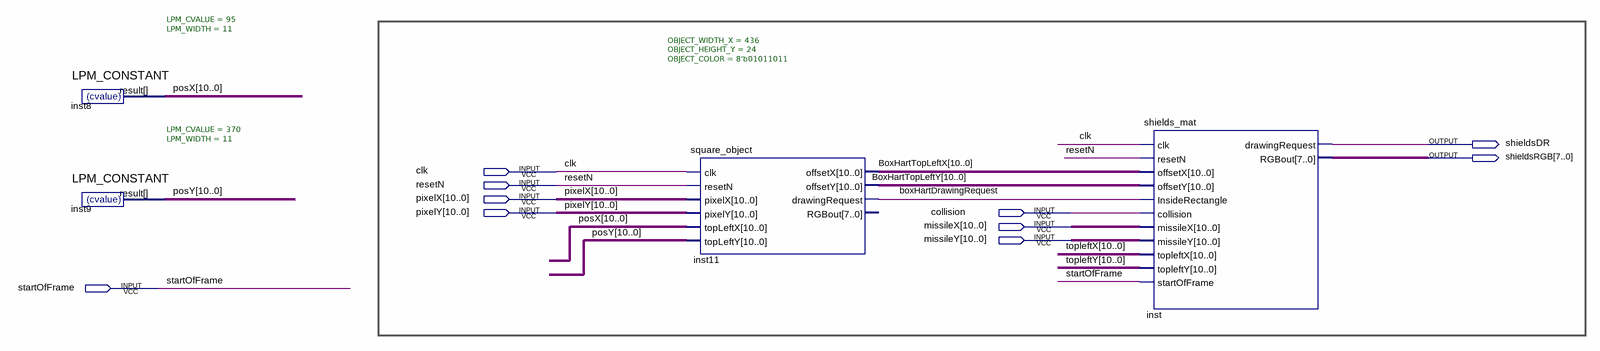
[diagram p0: schematic sheet]
// Quartus schematic SHIELDS_BLOCK.bdf as structural Verilog: 4 symbols, 10 pins
module SHIELDS_BLOCK (
  input  clk,
  input  resetN,
  input  [10:0] pixelX,
  input  [10:0] pixelY,
  input  collision,
  input  [10:0] missileX,
  input  [10:0] missileY,
  input  startOfFrame,
  output shieldsDR,
  output [7:0] shieldsRGB
);

  wire boxHartDrawingRequest;
  wire [10:0] BoxHartTopLeftX, BoxHartTopLeftY, posX, posY, topleftX, topleftY;

  LPM_CONSTANT #(.LPM_CVALUE(95), .LPM_WIDTH(11)) inst8 (.result(posX));
  LPM_CONSTANT #(.LPM_CVALUE(370), .LPM_WIDTH(11)) inst9 (.result(posY));
  square_object #(.OBJECT_WIDTH_X(436), .OBJECT_HEIGHT_Y(24), .OBJECT_COLOR(8'b01011011)) inst11 (
    .clk(clk), .resetN(resetN), .pixelX(pixelX), .pixelY(pixelY), .topLeftX(posX), .topLeftY(posY),
    .offsetX(BoxHartTopLeftX), .offsetY(BoxHartTopLeftY), .drawingRequest(boxHartDrawingRequest));  // open: RGBout
  shields_mat inst (
    .clk(clk), .resetN(resetN), .offsetX(BoxHartTopLeftX), .offsetY(BoxHartTopLeftY),
    .InsideRectangle(boxHartDrawingRequest), .collision(collision), .missileX(missileX), .missileY(missileY),
    .topleftX(topleftX), .topleftY(topleftY), .startOfFrame(startOfFrame), .drawingRequest(shieldsDR),
    .RGBout(shieldsRGB));
endmodule
